# EAGLE design VMPX_NH-Controller_ESP32-silck_panel_0603_V0_05 (EAGLE 9.3.0)
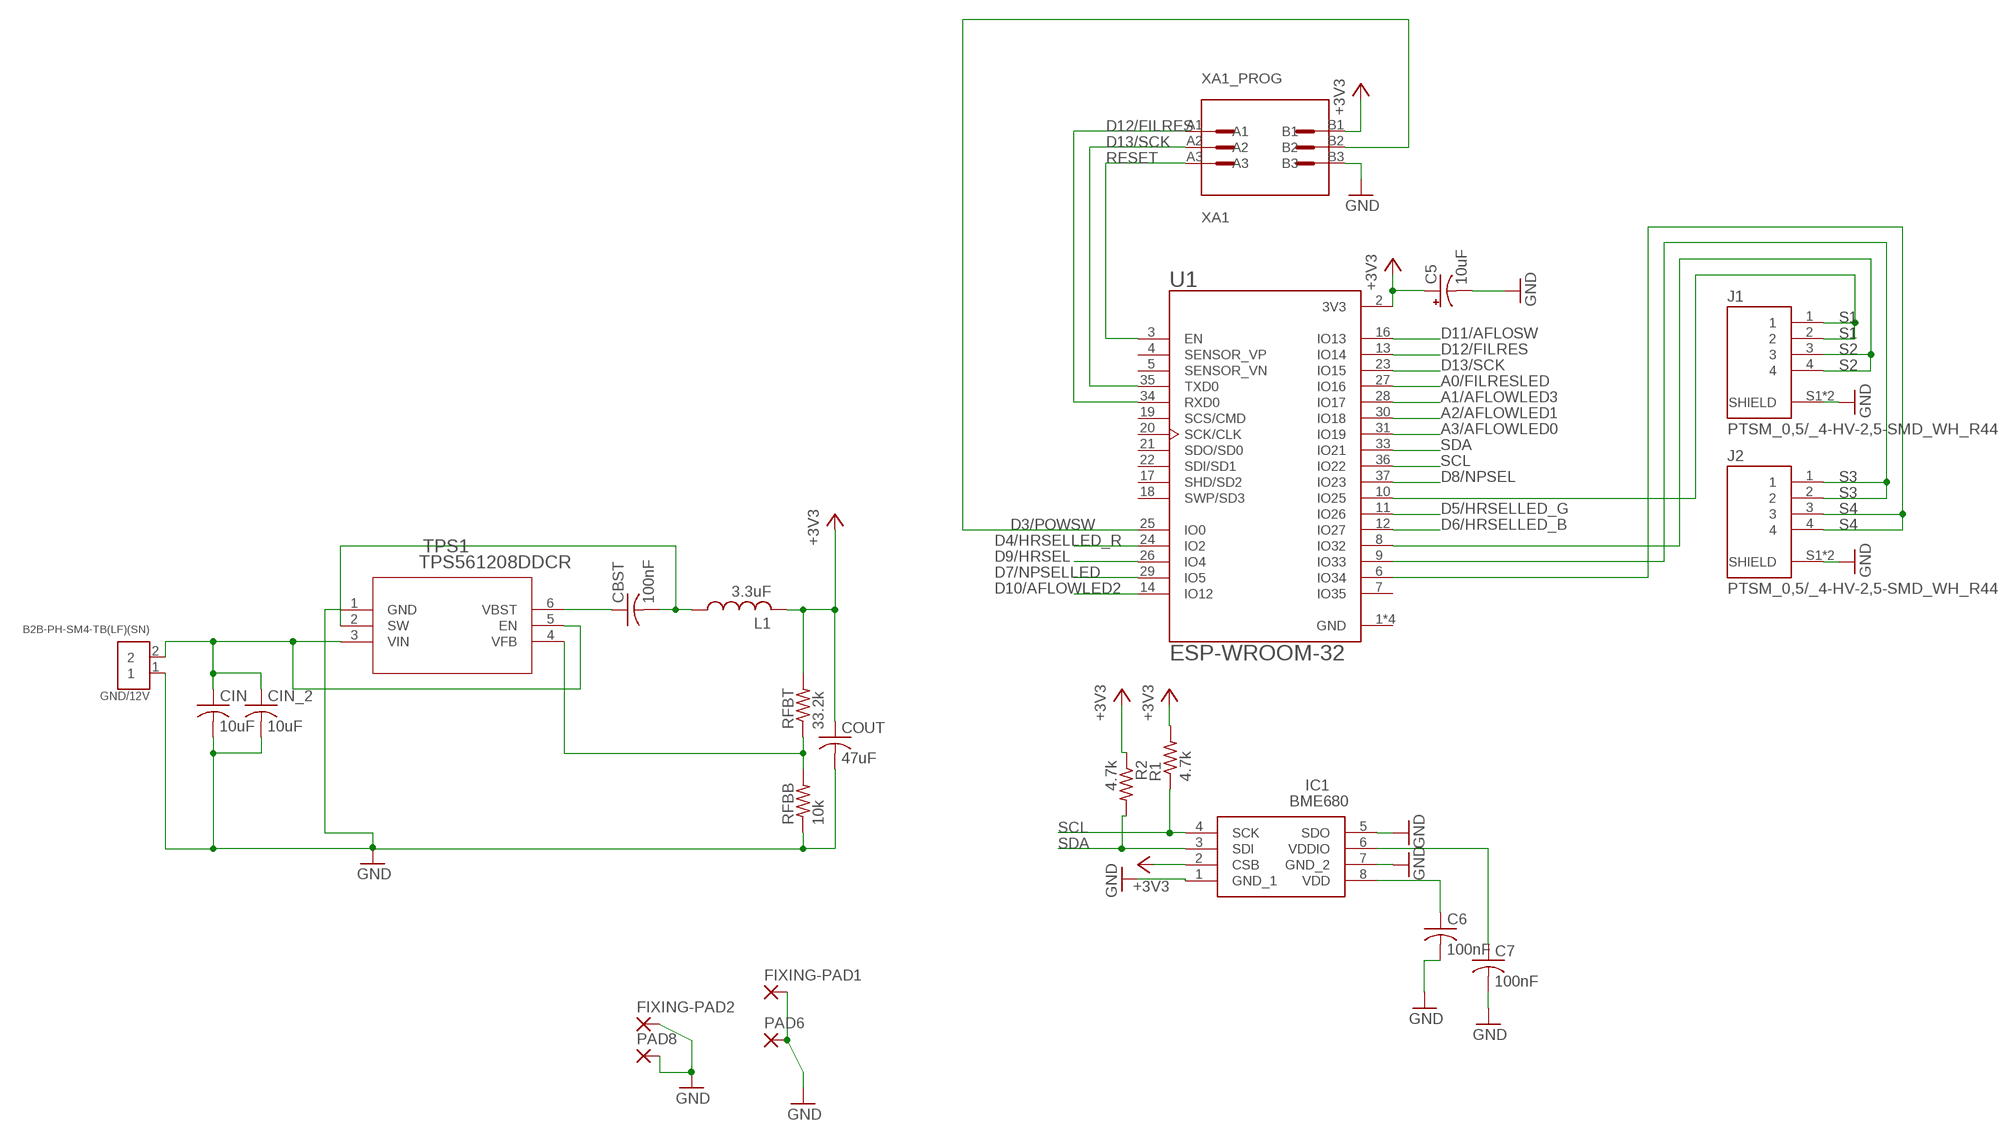
[diagram p0: schematic, sheet 1, part 1 of 2]
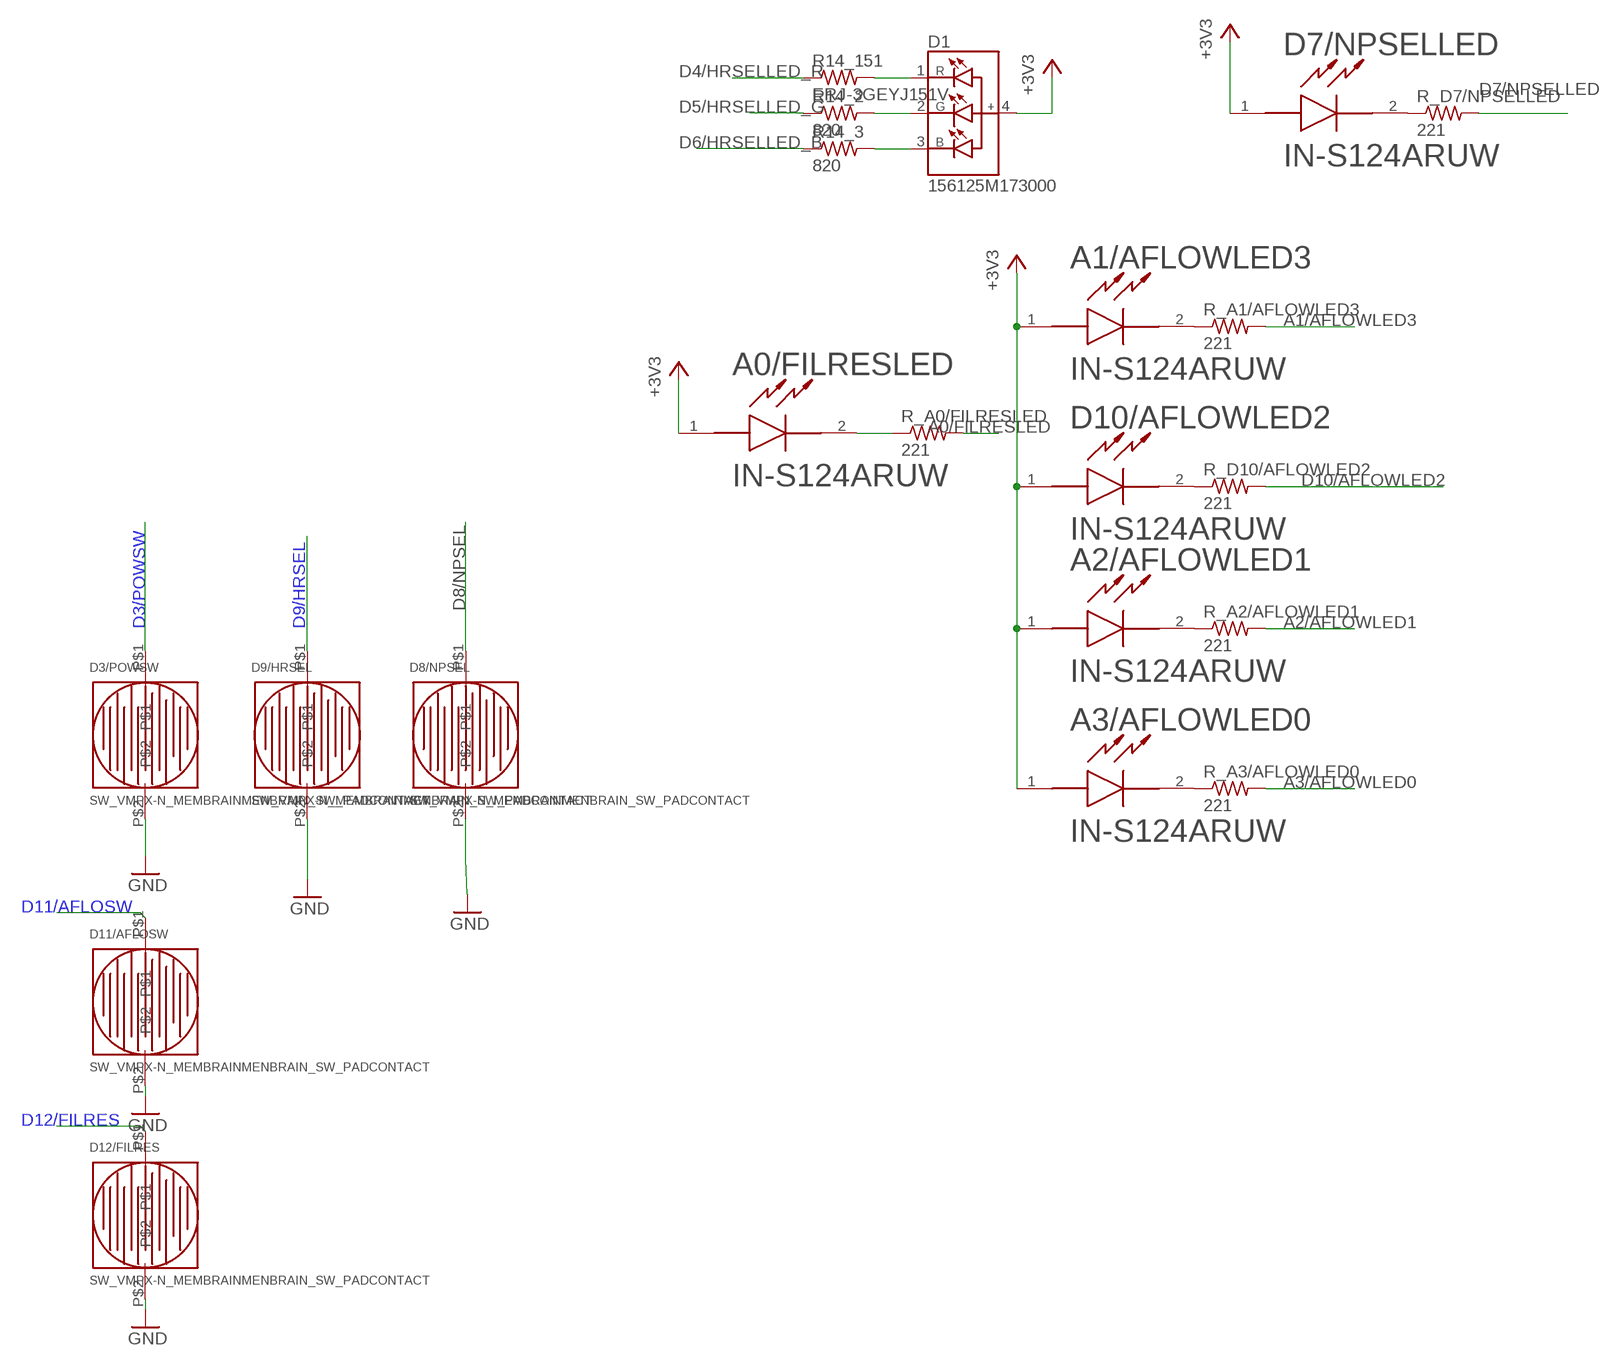
[diagram p1: schematic, sheet 1, part 2 of 2]

## Parts
A0/FILRESLED  IN-S124ARUW  [LED_IN-S124ARUW]
A1/AFLOWLED3  IN-S124ARUW  [LED_IN-S124ARUW]
A2/AFLOWLED1  IN-S124ARUW  [LED_IN-S124ARUW]
A3/AFLOWLED0  IN-S124ARUW  [LED_IN-S124ARUW]
C5  10uF  10UF-TANT  [EIA3216]
C6  100nF  C-USC0603  [C0603]
C7  100nF  C-USC0603  [C0603]
CBST  100nF  C-USC0603  [C0603]
CIN  10uF  C-USC0603  [C0603]
CIN_2  10uF  C-USC0603  [C0603]
COUT  47uF  C-USC0603  [C0603]
D1  156125M173000  [LED_156125M173000]
D3/POWSW  SW_VMPX-N_MEMBRAINMENBRAIN_SW_PADCONTACT  [MENBRANSWITCHCONTACT]
D7/NPSELLED  IN-S124ARUW  [LED_IN-S124ARUW]
D8/NPSEL  SW_VMPX-N_MEMBRAINMENBRAIN_SW_PADCONTACT  [MENBRANSWITCHCONTACT]
D9/HRSEL  SW_VMPX-N_MEMBRAINMENBRAIN_SW_PADCONTACT  [MENBRANSWITCHCONTACT]
D10/AFLOWLED2  IN-S124ARUW  [LED_IN-S124ARUW]
D11/AFLOSW  SW_VMPX-N_MEMBRAINMENBRAIN_SW_PADCONTACT  [MENBRANSWITCHCONTACT]
D12/FILRES  SW_VMPX-N_MEMBRAINMENBRAIN_SW_PADCONTACT  [MENBRANSWITCHCONTACT]
FIXING-PAD1  SMD5  [SMD2,54-5,08]
FIXING-PAD2  SMD5  [SMD2,54-5,08]
GND/12V  B2B-PH-SM4-TB(LF)(SN)  [JST_B2B-PH-SM4-TB(LF)(SN)]
IC1  BME680  [BME680]
J1  PTSM_0,5/_4-HV-2,5-SMD_WH_R44  [PHOENIX_PTSM_0,5/_4-HV-2,5-SMD_WH_R44]
J2  PTSM_0,5/_4-HV-2,5-SMD_WH_R44  [PHOENIX_PTSM_0,5/_4-HV-2,5-SMD_WH_R44]
L1  3.3uF  L-USL2012C  [L2012C]
PAD6  SMD5  [SMD2,54-5,08]
PAD8  SMD5  [SMD2,54-5,08]
R1  4.7k  ERJ-3GEYJ103V  [RESC1608X55]
R2  4.7k  ERJ-3GEYJ103V  [RESC1608X55]
R14_2  820  ERJ-3GEYJ151V  [RESC1608X55]
R14_3  820  ERJ-3GEYJ151V  [RESC1608X55]
R14_151  ERJ-3GEYJ151V  [RESC1608X55]
R_A0/FILRESLED  221  ERJ-3GEYJ221V  [RESC1608X55]
R_A1/AFLOWLED3  221  ERJ-3GEYJ221V  [RESC1608X55]
R_A2/AFLOWLED1  221  ERJ-3GEYJ221V  [RESC1608X55]
R_A3/AFLOWLED0  221  ERJ-3GEYJ221V  [RESC1608X55]
R_D7/NPSELLED  221  ERJ-3GEYJ221V  [RESC1608X55]
R_D10/AFLOWLED2  221  ERJ-3GEYJ221V  [RESC1608X55]
RFBB  10k  R-US_R0603  [R0603]
RFBT  33.2k  R-US_R0603  [R0603]
TPS1  TPS561208DDCR  [DDC6]
U1  ESP-WROOM-32  [MODULE_ESP-WROOM-32]
XA1_PROG  XA1  5-146130-2  [TE_5-146130-2]

## Nets
+3V3: A0/FILRESLED.1(A) A1/AFLOWLED3.1(A) A2/AFLOWLED1.1(A) A3/AFLOWLED0.1(A) C5.A(+) COUT.1 D1.4(+) D7/NPSELLED.1(A) D10/AFLOWLED2.1(A) IC1.2(CSB) L1.2 R1.2 R2.1 RFBT.2 U1.2(3V3) XA1_PROG.B1
A0/FILRESLED: R_A0/FILRESLED.2 U1.27(IO16)
A1/AFLOWLED3: R_A1/AFLOWLED3.2 U1.28(IO17)
A2/AFLOWLED1: R_A2/AFLOWLED1.2 U1.30(IO18)
A3/AFLOWLED0: R_A3/AFLOWLED0.2 U1.31(IO19)
D3/POWSW: D3/POWSW.P$1 U1.25(IO0) XA1_PROG.B2
D4/HRSELLED_R: R14_151.1 U1.24(IO2)
D5/HRSELLED_G: R14_2.1 U1.11(IO26)
D6/HRSELLED_B: R14_3.1 U1.12(IO27)
D7/NPSELLED: R_D7/NPSELLED.2 U1.29(IO5)
D8/NPSEL: D8/NPSEL.P$1 U1.37(IO23)
D9/HRSEL: D9/HRSEL.P$1 U1.26(IO4)
D10/AFLOWLED2: R_D10/AFLOWLED2.2 U1.14(IO12)
D11/AFLOSW: D11/AFLOSW.P$1 U1.16(IO13)
D12/FILRES: D12/FILRES.P$1 U1.13(IO14) U1.34(RXD0) XA1_PROG.A1
D13/SCK: U1.23(IO15) U1.35(TXD0) XA1_PROG.A2
GND: C5.C(-) C6.2 C7.2 CIN.2 CIN_2.2 COUT.2 D3/POWSW.P$2 D8/NPSEL.P$2 D9/HRSEL.P$2 D11/AFLOSW.P$2 D12/FILRES.P$2 FIXING-PAD1.1(P) FIXING-PAD2.1(P) GND/12V.1 IC1.1(GND_1) IC1.5(SDO) IC1.7(GND_2) J1.S1(SHIELD) J1.S2(SHIELD) J2.S1(SHIELD) J2.S2(SHIELD) PAD6.1(P) PAD8.1(P) RFBB.1 TPS1.1(GND) XA1_PROG.B3
N$1: A0/FILRESLED.2(C) R_A0/FILRESLED.1
N$3: C6.1 IC1.8(VDD)
N$4: D1.2(G-) R14_2.2
N$5: C7.1 IC1.6(VDDIO)
N$8: D1.3(B-) R14_3.2
N$9: D1.1(R-) R14_151.2
N$10: D7/NPSELLED.2(C) R_D7/NPSELLED.1
N$12: D10/AFLOWLED2.2(C) R_D10/AFLOWLED2.1
N$15: A1/AFLOWLED3.2(C) R_A1/AFLOWLED3.1
N$16: A2/AFLOWLED1.2(C) R_A2/AFLOWLED1.1
N$17: A3/AFLOWLED0.2(C) R_A3/AFLOWLED0.1
RESET: U1.3(EN) XA1_PROG.A3
S1: J1.1 J1.2 U1.10(IO25)
S2: J1.3 J1.4 U1.8(IO32)
S3: J2.1 J2.2 U1.9(IO33)
S4: J2.3 J2.4 U1.6(IO34)
SCL: IC1.4(SCK) R1.1 U1.36(IO22)
SDA: IC1.3(SDI) R2.2 U1.33(IO21)
SW: CBST.2 L1.1 TPS1.2(SW)
VBF: RFBB.2 RFBT.1 TPS1.4(VFB)
VBST: CBST.1 TPS1.6(VBST)
VIN: CIN.1 CIN_2.1 GND/12V.2 TPS1.3(VIN) TPS1.5(EN)
Unconnected: U1.4(SENSOR_VP) U1.5(SENSOR_VN) U1.7(IO35) U1.17(SHD/SD2) U1.18(SWP/SD3) U1.19(SCS/CMD) U1.20(SCK/CLK) U1.21(SDO/SD0) U1.22(SDI/SD1)

## Power pins joined to a net without a drawn wire
GND: U1.1(GND) U1.1.1(GND) U1.15(GND) U1.38(GND)

## Library data of the parts
A0/FILRESLED A1/AFLOWLED3 A2/AFLOWLED1 A3/AFLOWLED0 D7/NPSELLED D10/AFLOWLED2 = IN-S124ARUW:IN-S124ARUW: TOP VIEW / REVERSE MOUNT / 1205; AVAILABILITY: Good; DESCRIPTION: TOP VIEW / REVERSE MOUNT / 1205; MF: Inolux; MP: IN-S124ARUW; PACKAGE: SMD-2 Inolux; PRICE: 0.18 USD
C5 = SparkFun-Retired:10UF-TANT: 10uF Tantalum SMT CAP-00811- 16V 10% (EIA-3216); PROD_ID: CAP-00811
C6 C7 CBST CIN CIN_2 COUT = rcl:C-US: CAPACITOR, American symbol; SPICEPREFIX: C
D1 = SnapEDA-Library:156125M173000: Led, Red/Grn/Blue, 80/280/70mcd, 1205; MANUFACTURER: Wurth Electronics
D3/POWSW D8/NPSEL D9/HRSEL D11/AFLOSW D12/FILRES = sw_VMPX-N_Membrain2:SW_VMPX-N_MEMBRAIN
FIXING-PAD1 FIXING-PAD2 PAD6 PAD8 = wirepad:SMD5: SMD PAD
GND/12V = SnapEDA-Library_20180109:B2B-PH-SM4-TB(LF)(SN): PH Series 2 Position 2 mm Pitch Surface Mount Top Entry Shrouded Header; MANUFACTURER: JST
IC1 = BME680:BME680: Air Quality Sensors Environmental Sensor VOC IIR EMC Source: Datasheet <https://ae-bst.resource.bosch.com/media/_tech/media/datasheets/BST-BME680-DS001-00.pdf>; DESCRIPTION: Air Quality Sensors Environmental Sensor VOC IIR EMC; HEIGHT: mm; MANUFACTURER_NAME: Bosch Sensortec; MANUFACTURER_PART_NUMBER: BME680; MOUSER_PART_NUMBER: 262-BME680; MOUSER_PRICE-STOCK: https://www.mouser.com/Search/Refine.aspx?Keyword=262-BME680; RS_PART_NUMBER: 1767943; RS_PRICE-STOCK: http://uk.rs-online.com/web/p/products/1767943
J1 J2 = SnapEDA-Library:PTSM_0,5/_4-HV-2,5-SMD_WH_R44: Ptsm 0.5/ 4-Hv-2.5-Smd Wh R44; MANUFACTURER: TE Connectivity
L1 = rcl:L-US: INDUCTOR, American symbol; SPICEPREFIX: L
R1 R2 = ERJ-3GEYJ103V:ERJ-3GEYJ103V: Resistor;Thick Film;Res 10 Kilohms;Pwr-Rtg 0.1 W;Tol 5%;SMT;0603;Tape & Reel; AVAILABILITY: Good; DESCRIPTION: Res Thick Film 0603 10K Ohm 5% 0.1W(1/10W) Â±200ppm/Â°C Molded SMD Automotive Punched T/R; MF: Panasonic; MP: ERJ-3GEYJ103V; PACKAGE: 0603 Panasonic; PRICE: 0.02 USD
R14_2 R14_3 R14_151 = ERJ-3GEYJ151V:ERJ-3GEYJ151V: Resistor Thick Film Chip Size 1608; AVAILABILITY: Good; DESCRIPTION: Resistor, Chip Thick Film, 150 Ohm, 0.Resistor, Chip Thick Film, 150 Ohm, 0.1w, 5%, Full Reel; MF: Panasonic; MP: ERJ-3GEYJ151V; PACKAGE: 0603 Panasonic; PRICE: 0.01 USD
R_A0/FILRESLED R_A1/AFLOWLED3 R_A2/AFLOWLED1 R_A3/AFLOWLED0 R_D7/NPSELLED R_D10/AFLOWLED2 = ERJ-3GEYJ221V:ERJ-3GEYJ221V: THICK FILM CHIP RESISTOR, 220 OHM, 0.1W, 5%; DESCRIPTION: Resistor Thick Film 0603 220 Ohm 5% 1/10 Watt ±200ppm °C Surface Mount Punched Carrier Tape and Reel; DIGI-KEY_PART_NUMBER: P220GCT-ND; DIGI-KEY_PURCHASE_URL: https://www.digikey.jp/product-detail/en/panasonic-electronic-components/ERJ-3GEYJ221V/P220GCT-ND/134754?WT.z_cid=ref_snapeda&utm_source=snapeda&utm_medium=aggregator&utm_campaign=buynow; MF: Panasonic; MP: ERJ-3GEYJ221V; PACKAGE: 0603 Panasonic
RFBB RFBT = rcl:R-US_: RESISTOR, American symbol; SPICEPREFIX: R
TPS1 = Tps561208:TPS561208DDCR; MANUFACTURER_PART_NUMBER: TPS561208DDCR; VENDOR: Texas Instruments
U1 = ESP-WROOM-32:ESP-WROOM-32: Module: combo; GPIO, I2C x2, I2S x2, SDIO, SPI x3, UART x3; 19.5dBm; AVAILABILITY: Good; DESCRIPTION: Module: combo; GPIO, I2C x2, I2S x2, SDIO, SPI x3, UART x3; 19.5dBm; MF: Espressif Systems; MP: ESP-WROOM-32; PACKAGE: Module Espressif Systems; PRICE: 5.02 USD
XA1_PROG = 5-146130-2:5-146130-2: AMPMODU 6 Position Surface Mount Dual Row 0.1 Inch Straight Breakaway Header; AVAILABILITY: Good; CENTERLINE_(PITCH): 2.54 mm[.1 in]; COMMENT: 5-146130-2; DESCRIPTION: 06 MODII HDR DRST SFMNT B/A LF; EU_ROHS_COMPLIANCE: Compliant; LINK: http://www.te.com/usa-en/product-5-146130-2.html; MF: TE Connectivity; MP: 5-146130-2; NUMBER_OF_POSITIONS: 6; PACKAGE: None; PRICE: 0.69 USD; PRODUCT_TYPE: Connector

## Board
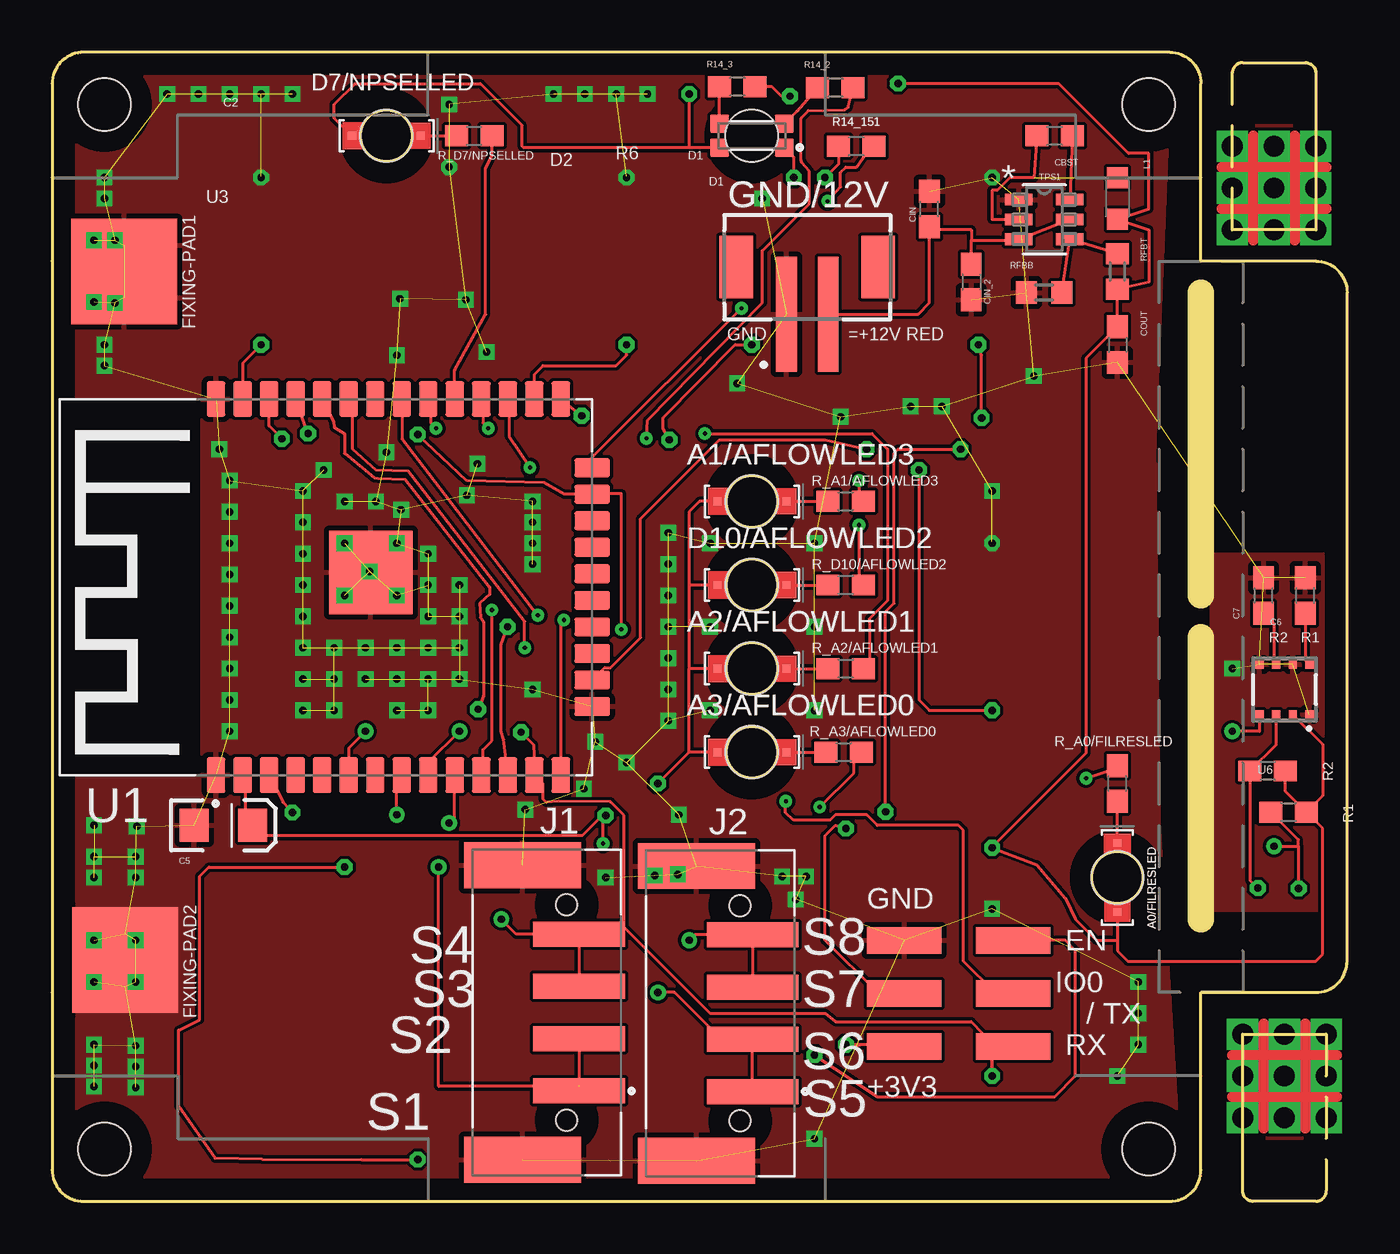
[diagram p2: board, top side]
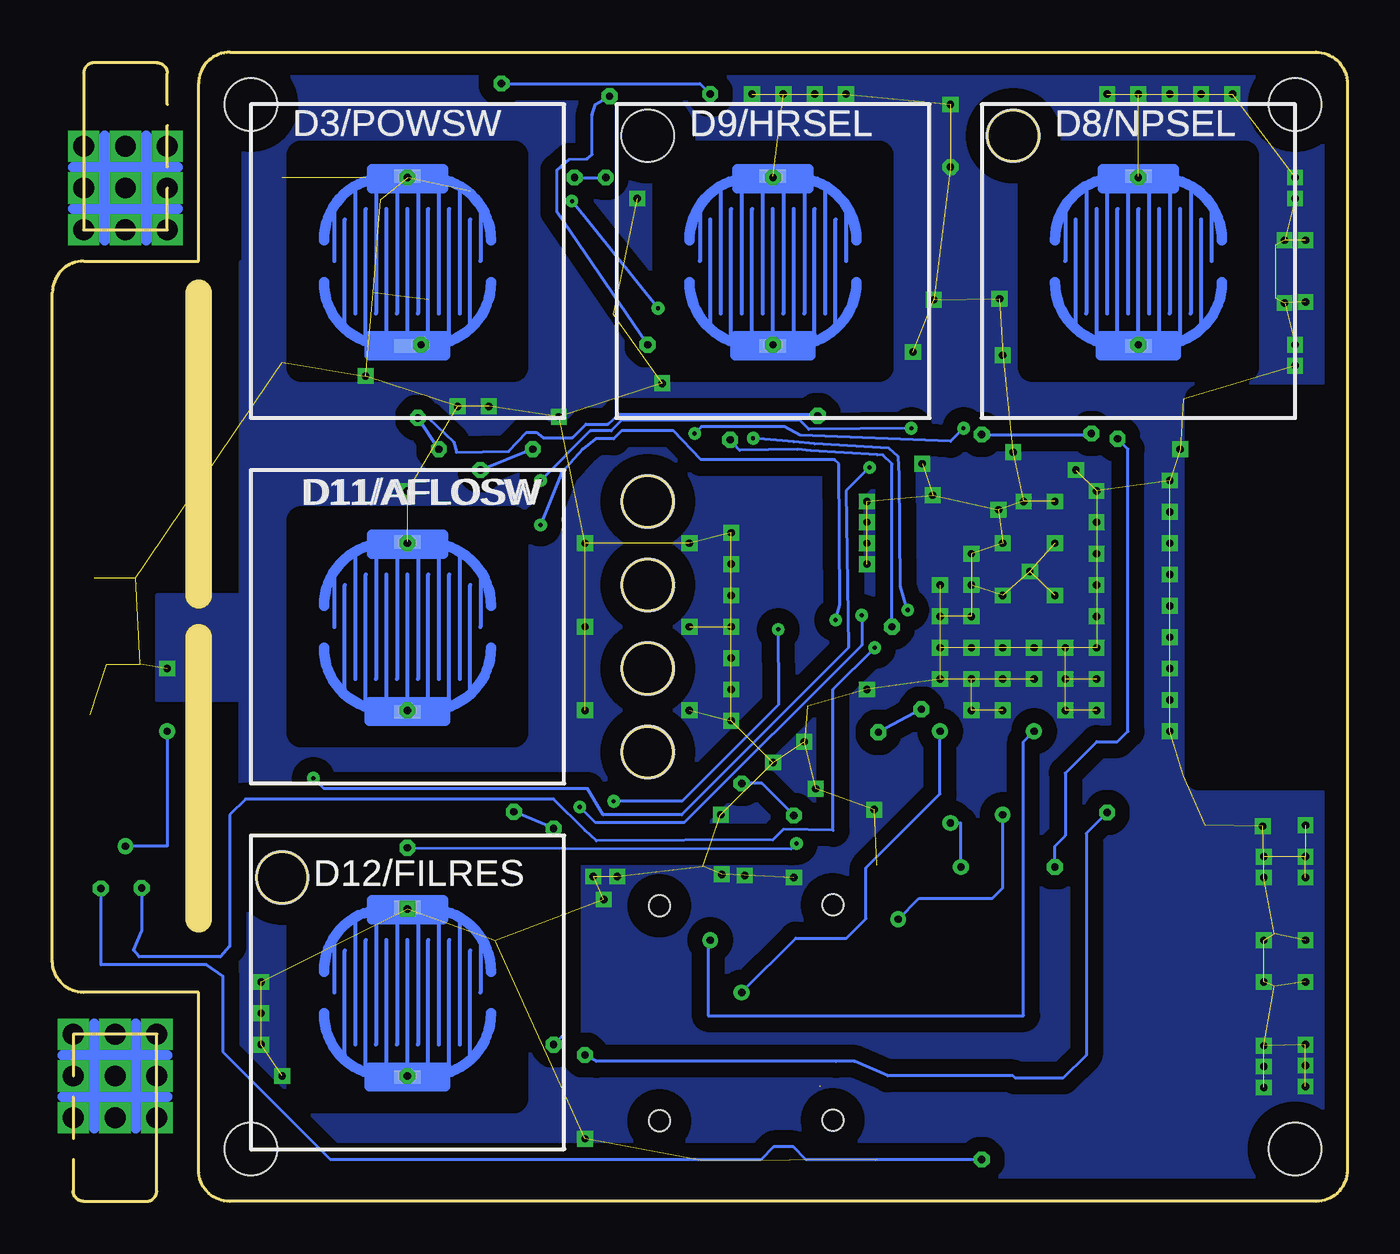
[diagram p3: board, bottom side, seen from below]

Size 62 x 55 mm. Coordinates in mm from the lower left corner, seen from the top.
Outline: 0,45 0,10
Outline: 1.5,0 53.5,0 arc90 55,1.5 55,10 60.5,10 arc90 62,11.5 62,43.5 arc90 60.5,45 55,45 55,53.5 arc90 53.5,55 1.5,55 arc90 0,53.5 0,1.5 arc90 1.5,0
Outline: 57,8 61,8 61,0.5 arc-90 60.5,0 57.5,0 arc-90 57,0.5 57,8
Outline: 60.5,46.5 56.5,46.5 56.5,54 arc-90 57,54.5 60,54.5 arc-90 60.5,54 60.5,46.5
Copper layers (1*16): Top 0.035mm / dielectric 1.5mm / Bottom 0.035mm
Design rules "default *": minimum track width 6mil, minimum drill 0.2mm, track to track 6mil, track to pad 6mil, pad to pad 6mil, via to via 6mil, smd to smd 6mil, copper to edge 40mil, drill to drill 6mil, minimum pad ring 10mil, minimum via ring 8mil, stop-mask expansion 4mil, vias tented up to drill 0mil, thermal gap 10mil
Holes 2.5 mm at 2.5,2.5 2.5,52.5 52.5,52.5 52.5,2.5 33.5,33.5 33.5,29.5 33.5,25.5 33.5,21.5 51,15.5 16,51 33.5,51
Milling: 2 lines

### Footprints (pad centres in the part's own frame; a part is rotated, then mirrored left to right if it is on the bottom)
LED_IN-S124ARUW = smd 0.381 x 0.381: 1 -1.651,0; 2 1.651,0 | hole 2.4: 0,0
EIA3216 = smd 1.4 x 1.6: A 1.4,0; C -1.4,0
C0603 = smd 1.1 x 1: 1 -0.85,0; 2 0.85,0
LED_156125M173000 = smd 0.9 x 0.85: 1 -1.55,0.575; 2 -1.55,-0.575; 3 1.55,-0.575; 4 1.55,0.575
MENBRANSWITCHCONTACT = smd 1.27 x 0.635: P$1 0,-4.064; P$2 0,4.064
SMD2,54-5,08 = smd 2.54 x 5.08: 1 0,0
JST_B2B-PH-SM4-TB(LF)(SN) = smd 1 x 5.5: 1 -1,0; 2 1,0 | smd 1.6 x 3: 3 -3.4,2.25; 4 3.4,2.25
BME680 = smd 0.4 x 0.4: 1 -1.2,-1.2; 2 -1.2,-0.4; 3 -1.2,0.4; 4 -1.2,1.2; 5 1.2,1.2; 6 1.2,0.4; 7 1.2,-0.4; 8 1.2,-1.2
PHOENIX_PTSM_0,5/_4-HV-2,5-SMD_WH_R44 = smd 1.2 x 4.4: 1 -3.75,-2.7; 2 -1.25,-2.7; 3 1.25,-2.7; 4 3.75,-2.7 | smd 2.2 x 5.6: S1 -7.05,0; S2 7.05,0 | hole 1: -5.15,-2.1; 5.15,-2.1
L2012C = smd 1 x 1: 1 -1,0; 2 1,0
RESC1608X55 = smd 1.1 x 1: 1 -0.85,0; 2 0.85,0
R0603 = smd 1 x 1.1: 1 -0.85,0; 2 0.85,0
DDC6 = smd 1.321 x 0.559: 1 -1.219,0.95; 2 -1.219,0; 3 -1.219,-0.95; 4 1.219,-0.95; 5 1.219,0; 6 1.219,0.95
MODULE_ESP-WROOM-32 = smd 1.7 x 0.9: 1 -9,8.255; 2 -9,6.985; 3 -9,5.715; 4 -9,4.445; 5 -9,3.175; 6 -9,1.905; 7 -9,0.635; 8 -9,-0.635; 9 -9,-1.905; 10 -9,-3.175; 11 -9,-4.445; 12 -9,-5.715; 13 -9,-6.985; 14 -9,-8.255; 25 9,-8.255; 26 9,-6.985; 27 9,-5.715; 28 9,-4.445; 29 9,-3.175; 30 9,-1.905; 31 9,-0.635; 32 9,0.635; 33 9,1.905; 34 9,3.175; 35 9,4.445; 36 9,5.715; 37 9,6.985; 38 9,8.255 | smd 4 x 4: 1.1 0.7,0.845 | smd 0.9 x 1.7: 15 -5.715,-9.755; 16 -4.445,-9.755; 17 -3.175,-9.755; 18 -1.905,-9.755; 19 -0.635,-9.755; 20 0.635,-9.755; 21 1.905,-9.755; 22 3.175,-9.755; 23 4.445,-9.755; 24 5.715,-9.755
TE_5-146130-2 = smd 1.27 x 3.56: A1 -2.54,-2.605; A2 0,-2.605; A3 2.54,-2.605; B1 -2.54,2.605; B2 0,2.605; B3 2.54,2.605

### Placement (x,y rotation side)
A0/FILRESLED  51,15.5 90 top
A1/AFLOWLED3  33.5,33.5 0 top
A2/AFLOWLED1  33.5,25.5 0 top
A3/AFLOWLED0  33.5,21.5 0 top
C5  8.2,18 0 top
C6  60,29 90 top
C7  58,29 90 top
CBST  48,51 180 top
CIN  42,47.5 90 top
CIN_2  44,44 270 top
COUT  51,41 270 top
D1  33.5,51.01 180 top
D3/POWSW  45,45 0 bottom
D7/NPSELLED  16,51 0 top
D8/NPSEL  10,45 0 bottom
D9/HRSEL  27.5,45 0 bottom
D10/AFLOWLED2  33.5,29.5 0 top
D11/AFLOSW  45,27.5 0 bottom
D12/FILRES  45,10 0 bottom
FIXING-PAD1  3.45,45.75 90 top
FIXING-PAD2  3.5,12.8 90 top
GND/12V  36.15,42.47 0 top
IC1  59,24.5 90 top
J1  22.53,9.04 90 top
J2  30.84,9 90 top
L1  51,48 270 top
PAD6  3.45,43.25 90 top
PAD8  3.5,10.3 90 top
R1  59.2,18.63 0 top
R2  58.2,20.6 180 top
R14_2  37.5,53.3 180 top
R14_3  32.8,53.35 180 top
R14_151  38.5,50.5 180 top
R_A0/FILRESLED  51,20 90 top
R_A1/AFLOWLED3  38,33.5 0 top
R_A2/AFLOWLED1  38,25.5 0 top
R_A3/AFLOWLED0  37.9,21.5 0 top
R_D7/NPSELLED  20.2,51 0 top
R_D10/AFLOWLED2  38,29.5 0 top
RFBB  47.5,43.5 0 top
RFBT  51,44.5 270 top
TPS1  47.5,47 0 top
U1  16.1,29.4 90 top
XA1_PROG  43.4,9.95 90 top

### Tracks (layer width: path | path; a pad name or v marks a point on that pad's centre or on a via)
+3V3  (via drill 0.2, 0.35)
  Top 0.152: U1.2 9.12,20.38 9.25,20.25 9.25,18.25 9.5,18 C5.A 10.1,17.5 25.38,17.5 26.35,18.47 | v26.38,17.12 26.38,18.5 26.35,18.47 | D7/NPSELLED.1 13.5,51.85 13.5,52.5 14.49,53.49 20.5,53.49 22.5,51.5 22.5,50.5 22.57,50.44 30.5,50.44 | D1.4 30.5,50.44 | v30.5,53 30.5,50.44 | A1/AFLOWLED3.1 31,33.5 30.5,33 30.5,29.5 | 30.5,29.5 30.5,25.5 | 30.5,21.5 30.5,25.5 | A3/AFLOWLED0.1 30.5,21.5 | 26.35,18.47 v26.5,18.47 | v29,20 30.5,21.5 | 51,12.5 50,12.5 49,13.5 48.5,14.5 47.15,16.1 v45,16.93 45,16.95 49.5,21.45 49.5,40.35 COUT.1 RFBT.2 52.5,44 52.5,46.5 L1.2 52.5,47.5 52.5,50.16 51.53,50.16 48.19,53.5 v40.5,53.5 | 51,12.5 51,12 51.5,11.5 60.5,11.5 60.83,11.83 60.83,17.85 R1.2 | A2/AFLOWLED1.1 30.5,25.5 | D10/AFLOWLED2.1 30.5,29.5 | 38.69,7.5 v38,7.5 40.7,7.5 XA1_PROG.B1 40.97,7.59 40.88,7.68 | A0/FILRESLED.1 51,12.5 | IC1.2 60.83,21.87 60.83,19.41 R1.2 | R1.2 59.05,19.63 R2.1
  Bottom 0.152: v26.38,17.12 26.62,16.88 37.5,16.91 | v45,16.93 37.5,16.91 | v40.5,53.5 31,53.5 v30.5,53 | v26.5,18.47 28.03,20 v29,20 | 37.5,16.91 37.5,8 v38,7.5
A0/FILRESLED  (via drill 0.2)
  Top 0.152: v49.5,20.25 51,20.75 R_A0/FILRESLED.2 | v22.88,35.12 21.88,36.62 21.88,38.38 U1.27
  Bottom 0.152: v49.5,20.25 49,19.75 36.38,19.75 35.62,18.5 31.88,18.5 23.88,26.5 24,34 v22.88,35.12
A1/AFLOWLED3  (via drill 0.2)
  Top 0.152: v38.62,34.5 38.62,33.62 38.75,33.5 R_A1/AFLOWLED3.2 | v20.88,37 20.62,37.25 20.62,38.38 U1.28
  Bottom 0.152: v38.62,34.5 36.25,36.88 35.25,36.88 34.75,37.38 26.2,37.38 25.77,36.95 v20.88,37
A2/AFLOWLED1  (via drill 0.2)
  Top 0.152: v31.25,36.75 39.25,36.75 40,36 40,28.75 39.12,27.88 39.12,25.75 38.88,25.5 R_A2/AFLOWLED1.2 | v18.38,37 18.12,37.25 18.12,38.38 U1.30
  Bottom 0.152: v31.25,36.75 30.93,37.08 26.95,37.08 26.2,36.67 19,36.38 v18.38,37
A3/AFLOWLED0  (via drill 0.2)
  Top 0.152: R_A3/AFLOWLED0.2 38.38,21.12 38.38,20.5 v36.75,18.88 | v23.25,28.05 16.75,36.5 16.75,38.38 U1.31
  Bottom 0.152: v36.75,18.88 36,18.12 31.75,18.12 23.25,26.62 v23.25,28.05
D3/POWSW  (via drill 0.35)
  Top 0.152: XA1_PROG.B2 40.74,10 39.5,10 37,12.5 37,17.5 37.5,18 v38,17.85 | v39.9,18.64 39.9,28.22 40.3,28.62 40.3,35.8 40.5,36 v43.5,36 | v44.5,37.5 44.5,40.5 v44.35,41 | v25.35,37.6 U1.25
  Bottom 0.152: v38,17.85 v39.9,18.64 | v43.5,36 v44.5,37.5 44,37.5 42.8,36.35 42.65,35.85 40.15,35.9 39.3,36.8 38.85,36.8 38.5,36.55 37.1,36.55 36.45,37.2 35.41,37.2 34.88,37.68 25.37,37.68 v25.35,37.6 | D3/POWSW.P$1 44.94,41 v44.35,41
D4/HRSELLED_R  (via drill 0.2)
  Top 0.152: v37.12,47.88 37.75,48.55 37.75,49.25 38,49.5 38.5,49.5 39.12,50.38 39.25,50.5 R14_151.1 | U1.24 25.86,35.6 v33,42.75
  Bottom 0.152: v33,42.75 v37.12,47.88
D5/HRSELLED_G  (via drill 0.2)
  Top 0.152: v28.45,36.52 28.5,37.38 34,43 34,45.5 36.25,47.75 36.25,49.3 35.9,49.7 35.85,49.85 35.85,51.8 35.9,51.9 36.2,52.2 37.95,52.25 38.1,52.35 R14_2.1 | v21.05,28.3 21.05,22.05 20.62,21.62 20.62,20.5 U1.11
  Bottom 0.152: v28.45,36.52 26.5,36.35 25.5,36.25 21.95,36.05 21.5,35.65 21.45,34.75 21.4,29.45 v21.05,28.3
D6/HRSELLED_B  (via drill 0.35)
  Top 0.152: U1.12 21.61,22.11 21.5,22.5 21.5,26.65 v21.8,27.5 | v29.55,36.45 29.25,37 29.25,37.5 32.7,41 v33.5,41 | R14_3.1 34.47,53.34 34.92,52.89 v35.32,52.89
  Bottom 0.152: v21.8,27.5 21.8,35.3 22.22,35.72 22.5,35.73 25.7,35.93 26.33,35.99 29.09,35.94 v29.55,36.45 | v33.5,41 37.84,47.34 37.84,49.36 37.25,49.87 36.4,49.9 36.15,50.1 36.15,52 36,52.5 v35.32,52.89
D7/NPSELLED
  Top 0.152: 21.12,51 R_D7/NPSELLED.2 21.05,50.05 20.75,49.45 20.75,42.45 19.27,39.77 U1.29
D8/NPSEL  (via drill 0.35)
  Top 0.152: U1.37 9.12,38.5 9.12,40.12 v10,41
  Bottom 0.152: D8/NPSEL.P$1 v10,41
D9/HRSEL  (via drill 0.35)
  Top 0.152: U1.26 23.09,39.59 23.5,40 27,40 27.5,40.5 v27.5,41
  Bottom 0.152: D9/HRSEL.P$1 v27.5,41
D10/AFLOWLED2  (via drill 0.2)
  Top 0.152: v38.62,32.38 38.62,29.62 38.75,29.5 R_D10/AFLOWLED2.2 | U1.14 24.36,27.82 v24.5,27.82
  Bottom 0.152: v38.62,32.38 37.62,34.88 36.62,36 36,36.5 35.12,36.5 34.75,36.88 32.25,36.88 30.95,35.5 24.55,35.5 24.35,35.3 24.3,28.55 v24.5,27.82
D11/AFLOSW  (via drill 0.35)
  Top 0.152: U1.16 26.45,25.55 26.74,25.55 28.18,26.98 28.18,32.68 31.95,36.45 37,36.45 v39,36 | v41.5,35 41.5,24 42,23.5 v45,23.5
  Bottom 0.152: v39,36 v41.5,35 | D11/AFLOSW.P$1 v45,23.5
D12/FILRES  (via drill 0.35)
  Top 0.152: v45,6 45,6.75 45.17,7.38 | 45.62,7.38 46,7.38 XA1_PROG.A1 | 23.12,20.38 23.5,20 23.5,19.25 23.65,19.1 24.25,19.15 26.73,19.12 27.38,18.48 27.38,13.12 31.5,9 37,9 37.5,8.6 44,8.6 45.17,7.38 | 23.12,20.38 U1.13 | 45.17,7.38 XA1_PROG.A1 | XA1_PROG.A1 45.15,7.41 arc-90 45.03,7.53 45,7.5 v45,6 | v45,6 arc90 45.03,6.03 | U1.34 13.47,37.31 13.5,37.05 14,36.75 14,35.8 15.42,34.63 15.6,34.6 16.9,34.55 20.95,29.4 20.95,29.05 20.47,28.62 20.5,27.95 20.65,27.75 20.65,24.2 v20.39,23.55 | v22.45,22.45 23.05,21.85 23.12,20.38
  Bottom 0.152: v20.39,23.55 v22.45,22.45 | D12/FILRES.P$1 v45,6
D13/SCK  (via drill 0.2, 0.35)
  Top 0.152: v27.25,27.38 27.25,33.88 25.88,33.88 U1.23 24.5,33.85 23.55,34.4 19.85,34.5 v17.5,36.7 | XA1_PROG.A2 46,10 45.12,10 43.62,11.5 43.62,17.75 43.4,18 39.5,18 39,18.5 37.5,18.5 37.25,18.25 35.5,18.25 35.1,18.6 v35.12,19.15 | v12.25,36.75 U1.35
  Bottom 0.152: v27.25,27.38 27.23,24.2 27.23,23.77 31.84,19.16 v35.12,19.16 v35.12,19.15 | v17.5,36.7 12.4,36.7 v12.25,36.75
GND  (via drill 0.35)  (158 unrouted)
  Bottom 0.152: D12/FILRES.P$2 v45,14 | D11/AFLOSW.P$2 v45,31.5 | D8/NPSEL.P$2 v10,49 | D3/POWSW.P$2 v45,49 | D9/HRSEL.P$2 v27.5,49
  other vias: 19,49.5 56.5,25.5 45,34 4.05,17.95 28.5,53 16.5,40.5 19,52.5 5.5,53 34.95,15.55 26.5,15.5 13,35 16,35.85 23,33.5 23,32.5 23,31.5 23,30.5 2.5,49 2.5,48 2.5,41 2.5,40 2,18 2,16.5 2,15.5 13.5,25 15,25 16.5,25 18,25 13.5,26.5 15,26.5 16.5,26.5 18,26.5 36.1,15.55 35.6,14.45 28.85,15.6 29.95,15.65 4,16.5 4,15.5 4,7.45 2,7.5 2,6.5 2,5.5 2,46 2,43.05 3,43 2,12.5 4,12.5 2,10.5 4,10.5 4,6.45 4,5.45 3,46 19.85,33.8 23,24.5 47,39.5 8.5,34.5 8.5,31.5 8.5,27 8.5,24 25.45,19.75 19.8,43.15 20.8,40.65 29.5,32 29.5,30.5 29.5,29 29.5,27.5 29.5,26 29.5,24.5 29.5,23 27.5,21 32.8,39.15 34,48 27,53 25.5,53 24,53 42.6,38.05 41.1,38.05 36.5,3 18,23.5 16.5,23.5 13.5,23.5 8.5,25.5 8.5,28.5 8.5,33 8.5,22.5 8.5,30 8,36 12,26.5 12,25 12,23.5 12,28 12,29.5 12,31 12,32.5 12,34 14,33.5 20.35,35.3 30,18.5 52,10.5 52,9 52,7.5 51,6 7,53 8.5,53 10,53 11.5,53 22.65,18.75 31.5,31.5 31.5,27.5 31.5,23.5 36.5,31.5 36.5,27.5 36.5,23.5 37.75,37.55 16.65,43.2 18,28 18,29.5 19.5,28 19.5,26.5 19.5,25 14,31.5 16.5,31.5 14,29 16.5,29 15.2,30.15 15.5,33.5 18,31 19.5,29.5 26,22 16.7,33.1
  pour Top: 0.3,0.1 0,54.86 53.57,54.81 arc9 54.12,-0.1
  pour Bottom (isolate 0.711): 52.98,44.96 52.98,29.02 57,29 57,24 53,24 52.98,9.91 54.86,9.91 55.09,0 0,0 0,54.86 52.86,54.86 52.86,44.96
  pour Top: 55.5,31 61.5,31 61.5,23.5 61.25,16.08 61.25,13.91 55.5,13.91
  pour Top: 56.5,51.5 60.5,51.5 60.5,46.5 56.5,46.5
  pour Top: 57,8 61,8 61,3 57,3
  pour Top (no thermals): 1,14.5 6.5,14.5 6.5,9 6,8.5 1,8.5
N$1
  Top 0.152: A0/FILRESLED.2 R_A0/FILRESLED.1
N$2  (via drill 1)
  other vias: 59,8
N$3
  Top 0.152: C6.1 60,25.9 IC1.8
N$4
  Top 0.152: D1.2 35.65,52.19 R14_2.2
N$5
  Top 0.152: IC1.6 58.5,25.7 58.5,27.65 C7.1
N$8
  Top 0.152: D1.3 R14_3.2
N$9  (via drill 0.35)
  Top 0.152: R14_151.2 37.65,49.65 v37,49 | D1.1 35.5,49.98 v35.5,49
  Bottom 0.152: v37,49 v35.5,49
N$10
  Top 0.152: D7/NPSELLED.2 R_D7/NPSELLED.1
N$12
  Top 0.152: D10/AFLOWLED2.2 R_D10/AFLOWLED2.1
N$15
  Top 0.152: A1/AFLOWLED3.2 R_A1/AFLOWLED3.1
N$16
  Top 0.152: A2/AFLOWLED1.2 R_A2/AFLOWLED1.1
N$17
  Top 0.152: A3/AFLOWLED0.2 R_A3/AFLOWLED0.1
N$18  (via drill 1)
  other vias: 59,6
N$19  (via drill 1)
  other vias: 57,6
N$20  (via drill 1)
  other vias: 57,4
N$21  (via drill 1)
  other vias: 59,4
N$22  (via drill 1)
  other vias: 61,6
N$23  (via drill 1)
  other vias: 61,4
N$24  (via drill 1)
  other vias: 57,8
N$25  (via drill 1)
  other vias: 61,8
N$26  (via drill 1)
  other vias: 58.5,46.5
N$27  (via drill 1)
  other vias: 58.5,48.5
N$28  (via drill 1)
  other vias: 60.5,48.5
N$29  (via drill 1)
  other vias: 60.5,50.5
N$30  (via drill 1)
  other vias: 58.5,50.5
N$31  (via drill 1)
  other vias: 56.5,48.5
N$32  (via drill 1)
  other vias: 56.5,50.5
N$33  (via drill 1)
  other vias: 60.5,46.5
N$34  (via drill 1)
  other vias: 56.5,46.5
N$35
  Top 0.508: 58,8.5 58,3.5
N$36
  Top 0.508: 60,8.5 60,3.5
N$37
  Top 0.508: 56.5,5 61.5,5
N$38
  Top 0.508: 56.5,7 61.5,7
N$39
  Top 0.508: 57.5,46 57.5,51
N$40
  Top 0.508: 59.5,46 59.5,51
N$41
  Top 0.508: 56,49.5 61,49.5
N$42
  Top 0.508: 56,47.5 61,47.5
N$43
  Bottom 0.508: 59.5,51 59.5,46
N$44
  Bottom 0.508: 57.5,51 57.5,46
N$45
  Bottom 0.508: 61,49.5 56,49.5
N$46
  Bottom 0.508: 61,47.5 56,47.5
N$47
  Bottom 0.508: 60,8.5 60,3.5
N$48
  Bottom 0.508: 58,8.5 58,3.5
N$49
  Bottom 0.508: 61.5,5 56.5,5
N$50
  Bottom 0.508: 61.5,7 56.5,7
RESET  (via drill 0.35)
  Top 0.152: U1.3 11.05,19.1 v11.5,18.61 | XA1_PROG.A3 48.5,12.5 49,12 49,6 48,5 39.5,5 v36.5,7
  Bottom 0.152: v11.5,18.61 12.5,17.61 12.5,7 13.61,5.89 15.89,5.89 16,6 22,6 23.6,6.7 24.48,6.7 24.49,6.71 24.5,6.7 35.95,6.7 v36.5,7
S1  (via drill 0.35)  (1 unrouted)
  Top 0.152: J1.1 25.25,5.38 25.25,5.5 18.5,5.5 v18.5,16 | v19,18.11 19.27,18.11 U1.10 | J1.2 25.23,5.54 25.36,5.42
  Bottom 0.152: v18.5,16 18.5,18.11 v19,18.11
S2  (via drill 0.35)
  Top 0.152: J1.3 J1.4 22.21,12.79 v21.5,13.5 | v16.5,18.5 16.5,20.16 U1.8
  Bottom 0.152: v21.5,13.5 20.5,14.5 17,14.5 16.5,15 v16.5,18.5
S3  (via drill 0.35)
  Top 0.152: J2.1 J2.2 32.04,7.75 29.79,10 v29,10 | v19.5,22.5 18,21 U1.9
  Bottom 0.152: v19.5,22.5 19.5,19.5 23.04,15.96 23.04,13.53 23.97,12.6 26.4,12.6 v29,10
S4  (via drill 0.35)
  Top 0.152: J2.3 J2.4 30.75,12.75 v30.5,12.5 | v15,22.5 14.2,21.7 U1.6
  Bottom 0.152: v30.5,12.5 30.61,12.39 30.61,8.89 15.5,8.89 15.5,22 v15,22.5
SCL  (via drill 0.35)
  Top 0.152: v17.5,2 14.81,2 10.05,2 7.8,2.05 6.05,4.55 6.05,8.2 7.05,8.7 7.05,15.55 7.5,16 v14,16 | v11,36.5 10.38,37.12 U1.36 | R1.1 59.66,17.31 59.66,17 | IC1.4 57.8,22.5 v56.5,22.5 | v58.5,17 59.66,17 | 59.66,17 59.68,17 v59.68,14.97
  Bottom 0.152: v17.5,2 25.92,2 26.53,2.61 27.47,2.61 28.08,2 48.69,2 53.83,7.14 53.83,10.78 54.62,11.32 59.68,11.32 v59.68,14.97 | v14,16 14,17 13.5,17.5 13.5,20.5 12,22 11,22 10.5,22.5 10.5,36 v11,36.5 | v56.5,22.5 56.5,17 v58.5,17
SDA  (via drill 0.2, 0.35)
  Top 0.152: v22.62,26.5 22.62,27.75 17.05,34.95 15.5,35 14.38,36 14.38,38.25 14.25,38.38 U1.33 | v57.73,15 57.35,15.38 R2.2 58.6,21.85 IC1.3
  Bottom 0.152: v22.62,26.5 24.62,24.5 24.62,17.75 27,17.8 27.5,17.3 35.95,17.25 36.5,17.75 38,19.25 52.75,19.25 53.5,18.5 53.5,12.2 53.95,11.7 57.85,11.7 58.11,12.01 57.73,12.92 v57.73,15
SW  (1 unrouted)
  Top 0.152: CBST.2 47,49 45.86,49 45.25,48.39 45,48.39 45,47 TPS1.2
VBF
  Top 0.152: RFBT.1 TPS1.4 RFBB.2
VBST
  Top 0.152: CBST.1 TPS1.6
VIN
  Top 0.152: GND/12V.2 41.47,42.47 42,43 42,46.5 | 42,46.5 CIN.1 | 44,44.65 CIN_2.1 44,46 | TPS1.5 TPS1.3 46.28,46 44,46 | 42,46.5 44,46.5 44,46

### Text on the board
tNames: GND | =+12V RED | S8 | S4 | S3 | S7 | S6 | S2 | S1 | S5
_tNames: D7/NPSELLED | C2 | R14_151 | D2 | R6 | D1 | U3 | GND/12V | A1/AFLOWLED3 | D10/AFLOWLED2 | A2/AFLOWLED1 | R2 | R1 | A3/AFLOWLED0 | U6 | A0/FILRESLED | GND | EN | IO0 | / TX | RX | +3V3
_bNames: D9/HRSEL | D8/NPSEL | D3/POWSW | D11/AFLOSW | D12/FILRES